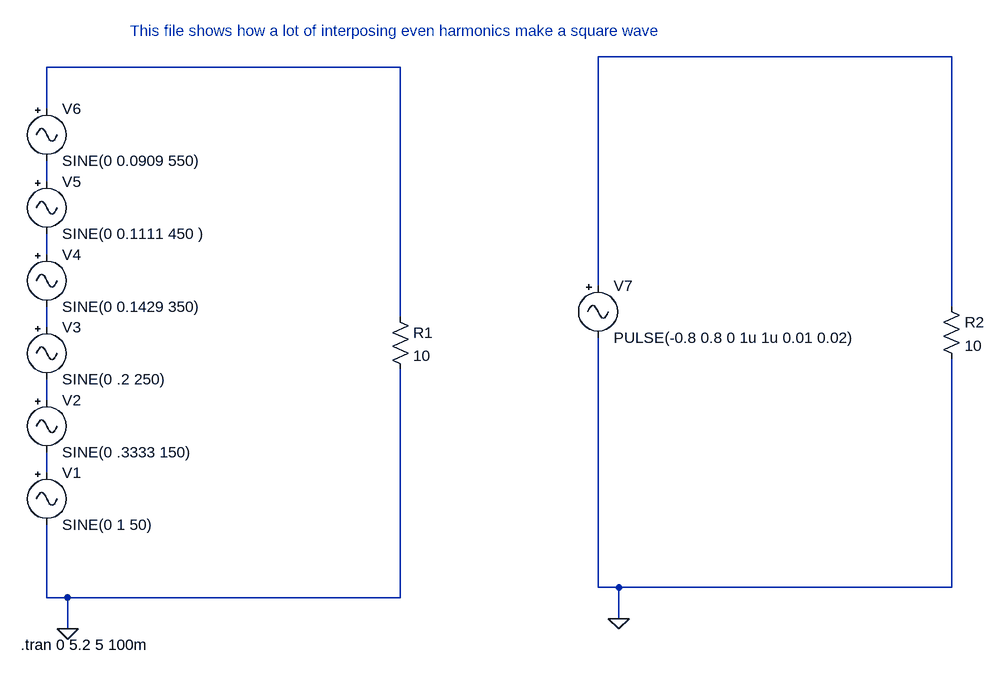
[diagram p0: schematic Fourier_Proof.asc]
Fourier_Proof.asc, the LTspice schematic file:
Version 4.1
SHEET 1 2476 680
WIRE 1504 -512 960 -512
WIRE 656 -496 112 -496
WIRE 112 -432 112 -496
WIRE 112 -320 112 -352
WIRE 112 -208 112 -240
WIRE 960 -160 960 -512
WIRE 1504 -128 1504 -512
WIRE 656 -112 656 -496
WIRE 112 -96 112 -128
WIRE 112 16 112 -16
WIRE 112 128 112 96
WIRE 960 304 960 -80
WIRE 992 304 960 304
WIRE 1504 304 1504 -48
WIRE 1504 304 992 304
WIRE 112 320 112 208
WIRE 144 320 112 320
WIRE 656 320 656 -32
WIRE 656 320 144 320
WIRE 992 352 992 304
WIRE 144 368 144 320
FLAG 144 368 0
FLAG 992 352 0
SYMBOL Misc\\signal 112 112 R0
WINDOW 123 0 0 Left 0
WINDOW 39 0 0 Left 0
SYMATTR InstName V1
SYMATTR Value SINE(0 1 50)
SYMBOL Misc\\signal 112 0 R0
WINDOW 123 0 0 Left 0
WINDOW 39 0 0 Left 0
SYMATTR InstName V2
SYMATTR Value SINE(0 .3333 150)
SYMBOL Misc\\signal 112 -112 R0
WINDOW 123 0 0 Left 0
WINDOW 39 0 0 Left 0
SYMATTR InstName V3
SYMATTR Value SINE(0 .2 250)
SYMBOL Misc\\signal 112 -224 R0
WINDOW 123 0 0 Left 0
WINDOW 39 0 0 Left 0
SYMATTR InstName V4
SYMATTR Value SINE(0 0.1429 350)
SYMBOL Misc\\signal 112 -336 R0
WINDOW 123 0 0 Left 0
WINDOW 39 0 0 Left 0
SYMATTR InstName V5
SYMATTR Value SINE(0 0.1111 450 )
SYMBOL Misc\\signal 112 -448 R0
WINDOW 123 0 0 Left 0
WINDOW 39 0 0 Left 0
SYMATTR InstName V6
SYMATTR Value SINE(0 0.0909 550)
SYMBOL res 640 -128 R0
SYMATTR InstName R1
SYMATTR Value 10
SYMBOL res 1488 -144 R0
SYMATTR InstName R2
SYMATTR Value 10
SYMBOL Misc\\signal 960 -176 R0
WINDOW 123 0 0 Left 0
WINDOW 39 0 0 Left 0
SYMATTR InstName V7
SYMATTR Value PULSE(-0.8 0.8 0 1u 1u 0.01 0.02)
TEXT 72 392 Left 2 !.tran 0 5.2 5 100m
TEXT 240 -552 Left 2 ;This file shows how a lot of interposing even harmonics make a square wave

The netlist it stands for:
* Fourier_Proof.asc
V1 N007 0 SINE(0 1 50)
V2 N006 N007 SINE(0 .3333 150)
V3 N005 N006 SINE(0 .2 250)
V4 N004 N005 SINE(0 0.1429 350)
V5 N003 N004 SINE(0 0.1111 450 )
V6 N002 N003 SINE(0 0.0909 550)
R1 N002 0 10
R2 N001 0 10
V7 N001 0 PULSE(-0.8 0.8 0 1u 1u 0.01 0.02)
.tran 0 5.2 5 100m
* This file shows how a lot of interposing even harmonics make a square wave
.backanno
.end